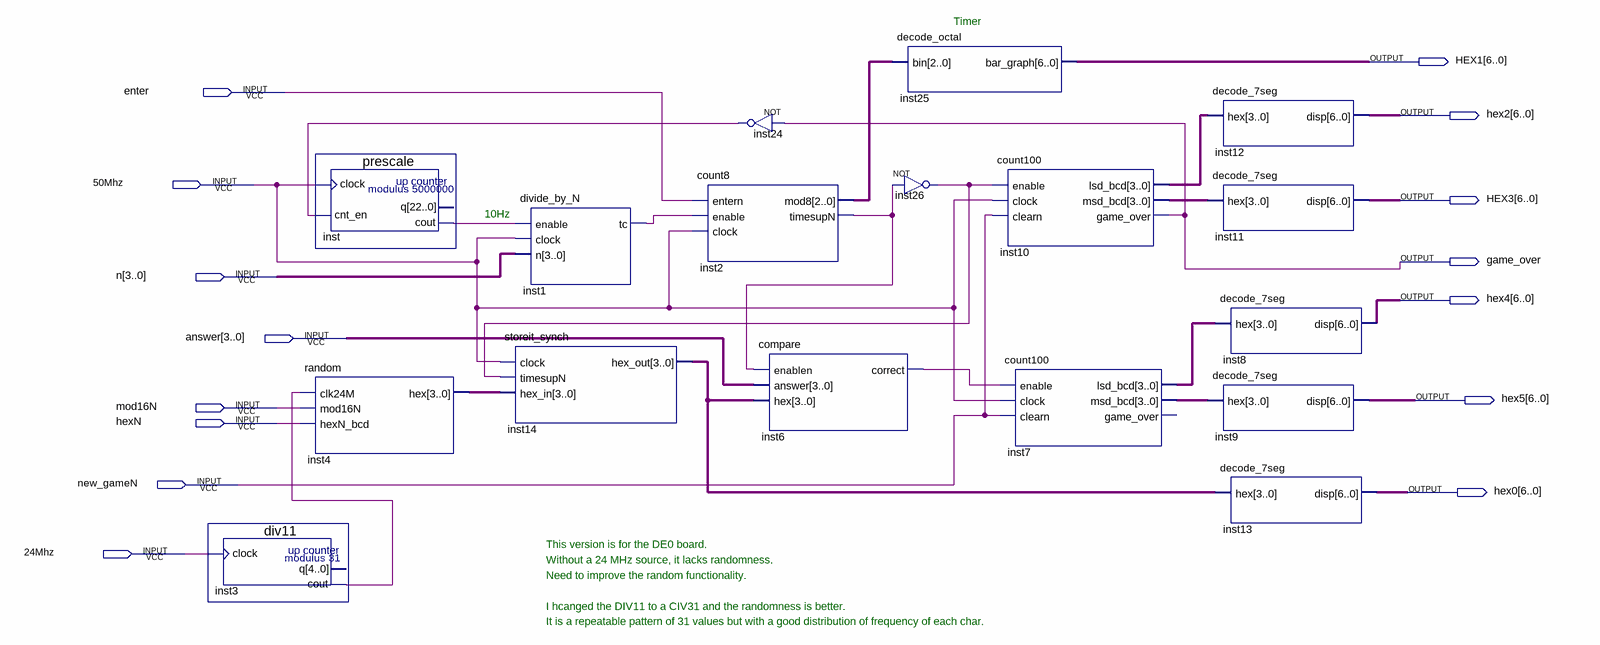
[diagram p0: schematic sheet]
// Quartus schematic hexbingame2.bdf as structural Verilog: 17 symbols, 15 pins
module hexbingame2 (
  input  enter,
  input  \50Mhz ,
  input  [3:0] n,
  input  [3:0] answer,
  input  mod16N,
  input  hexN,
  input  new_gameN,
  input  \24Mhz ,
  output [6:0] HEX1,
  output [6:0] hex2,
  output [6:0] HEX3,
  output game_over,
  output [6:0] hex4,
  output [6:0] hex5,
  output [6:0] hex0
);

  wire inst1_tc, inst2_timesupn, inst3_cout, inst6_correct, inst24_out, inst26_out, inst_cout;
  wire [2:0] inst2_mod8;
  wire [3:0] inst4_hex, inst7_lsd_bcd, inst7_msd_bcd, inst10_lsd_bcd, inst10_msd_bcd, inst14_hex_out;

  div11 inst3 (.clock(\24Mhz ), .cout(inst3_cout));  // open: q
  prescale inst (.clock(\50Mhz ), .cnt_en(inst24_out), .cout(inst_cout));  // open: q
  random inst4 (.clk24M(inst3_cout), .mod16N(mod16N), .hexN_bcd(hexN), .hex(inst4_hex));
  divide_by_N inst1 (.enable(inst_cout), .clock(\50Mhz ), .n(n), .tc(inst1_tc));
  storeit_synch inst14 (.clock(\50Mhz ), .timesupN(inst26_out), .hex_in(inst4_hex), .hex_out(inst14_hex_out));
  count8 inst2 (.entern(enter), .enable(inst1_tc), .clock(\50Mhz ), .mod8(inst2_mod8), .timesupN(inst2_timesupn));
  not inst24 (inst24_out, game_over);
  compare inst6 (.enablen(inst2_timesupn), .answer(answer), .hex(inst14_hex_out), .correct(inst6_correct));
  decode_octal inst25 (.bin(inst2_mod8), .bar_graph(HEX1));
  not inst26 (inst26_out, inst2_timesupn);
  count100 inst10 (
    .enable(inst26_out), .clock(\50Mhz ), .clearn(new_gameN), .lsd_bcd(inst10_lsd_bcd),
    .msd_bcd(inst10_msd_bcd), .game_over(game_over));
  count100 inst7 (
    .enable(inst6_correct), .clock(\50Mhz ), .clearn(new_gameN), .lsd_bcd(inst7_lsd_bcd),
    .msd_bcd(inst7_msd_bcd));  // open: game_over
  decode_7seg inst12 (.hex(inst10_lsd_bcd), .disp(hex2));
  decode_7seg inst11 (.hex(inst10_msd_bcd), .disp(HEX3));
  decode_7seg inst8 (.hex(inst7_lsd_bcd), .disp(hex4));
  decode_7seg inst9 (.hex(inst7_msd_bcd), .disp(hex5));
  decode_7seg inst13 (.hex(inst14_hex_out), .disp(hex0));

  // Notes on the sheet:
  //   Timer
  //   10Hz
  //   This version is for the DE0 board.
  //   Without a 24 MHz source, it lacks randomness. 
  //   Need to improve the random functionality.
  //   I hcanged the DIV11 to a CIV31 and the randomness is better.
  //   It is a repeatable pattern of 31 values but with a good distribution of frequency of each char. 
endmodule
